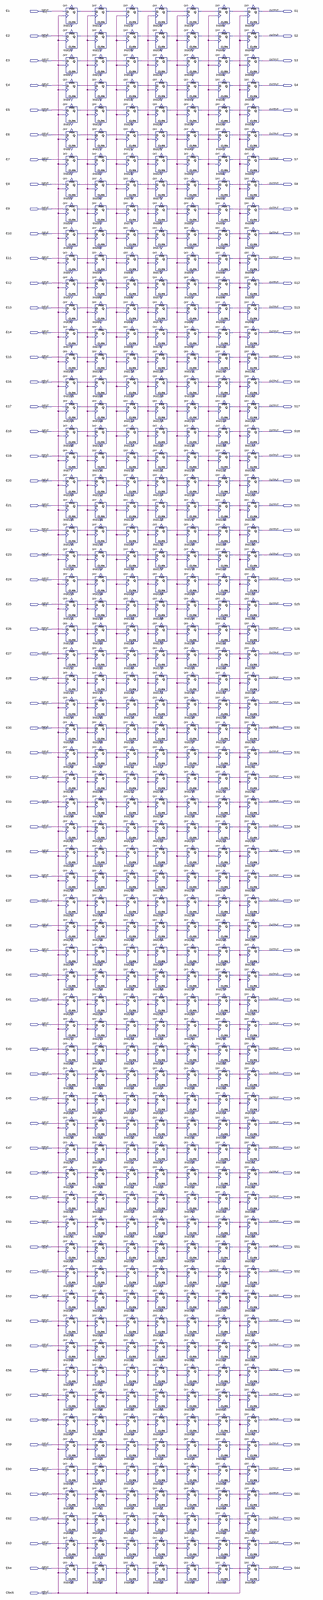
[diagram p0: schematic sheet, whole]
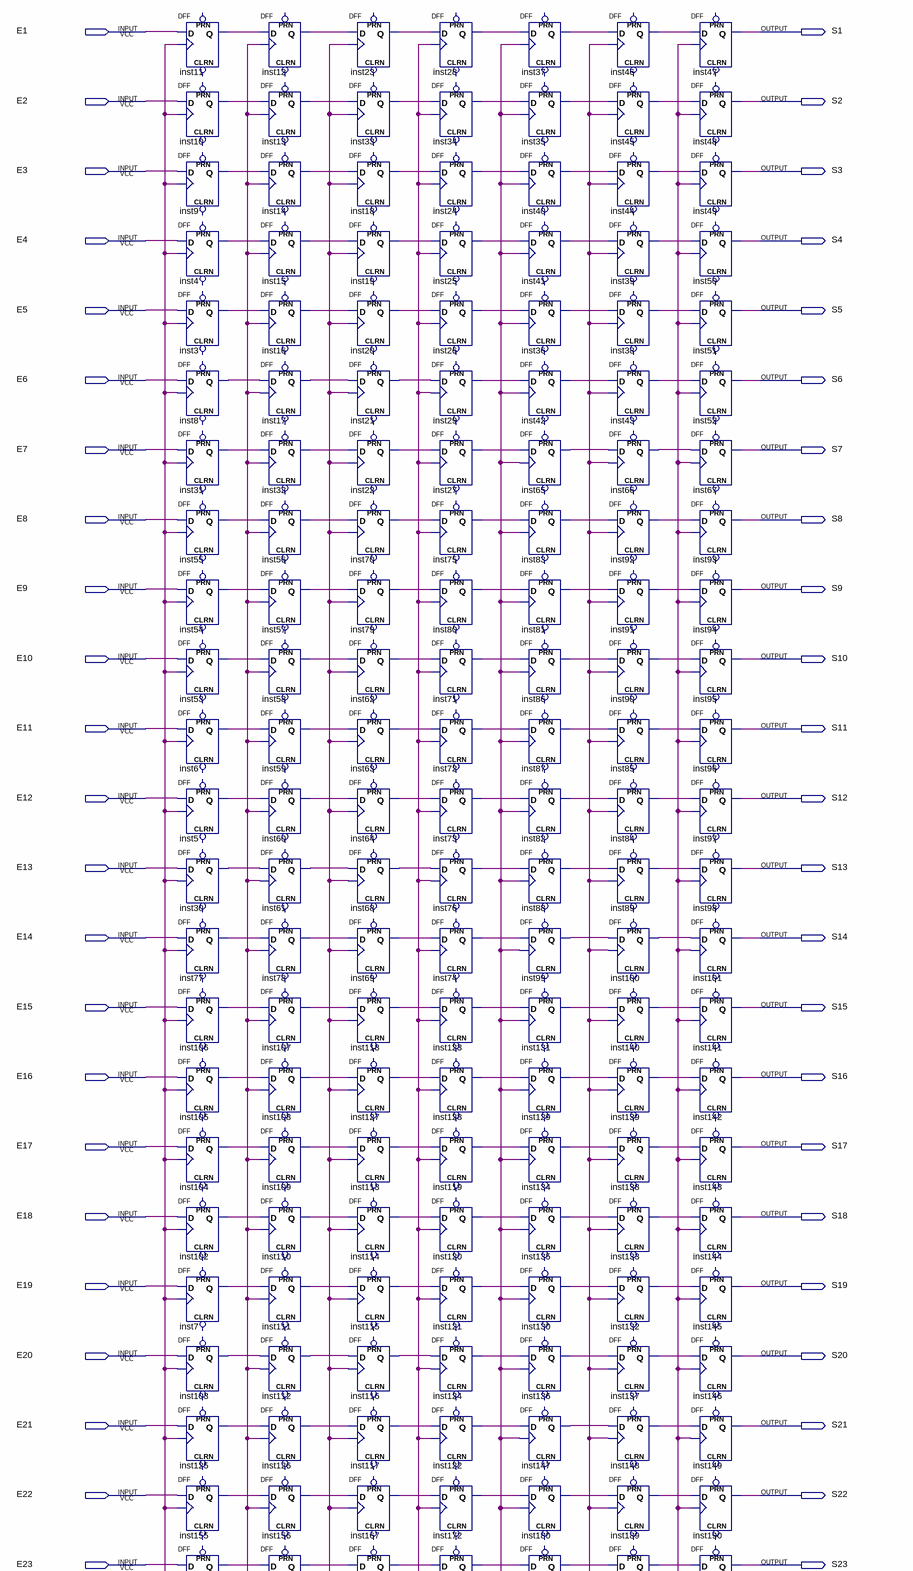
[diagram p1: schematic sheet, upper part]
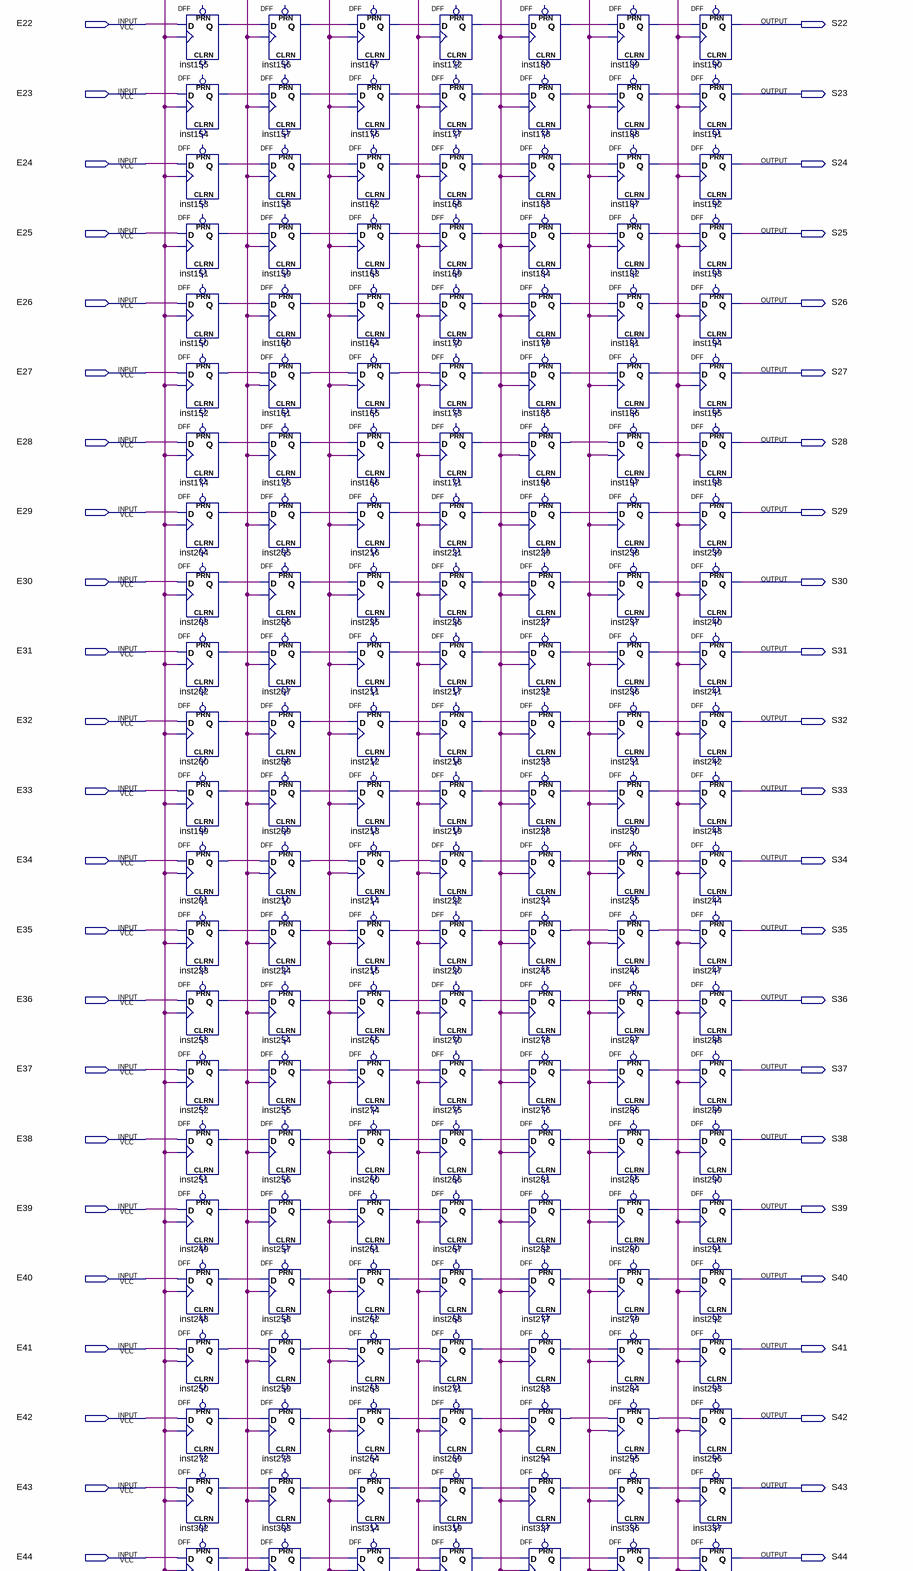
[diagram p2: schematic sheet, middle part]
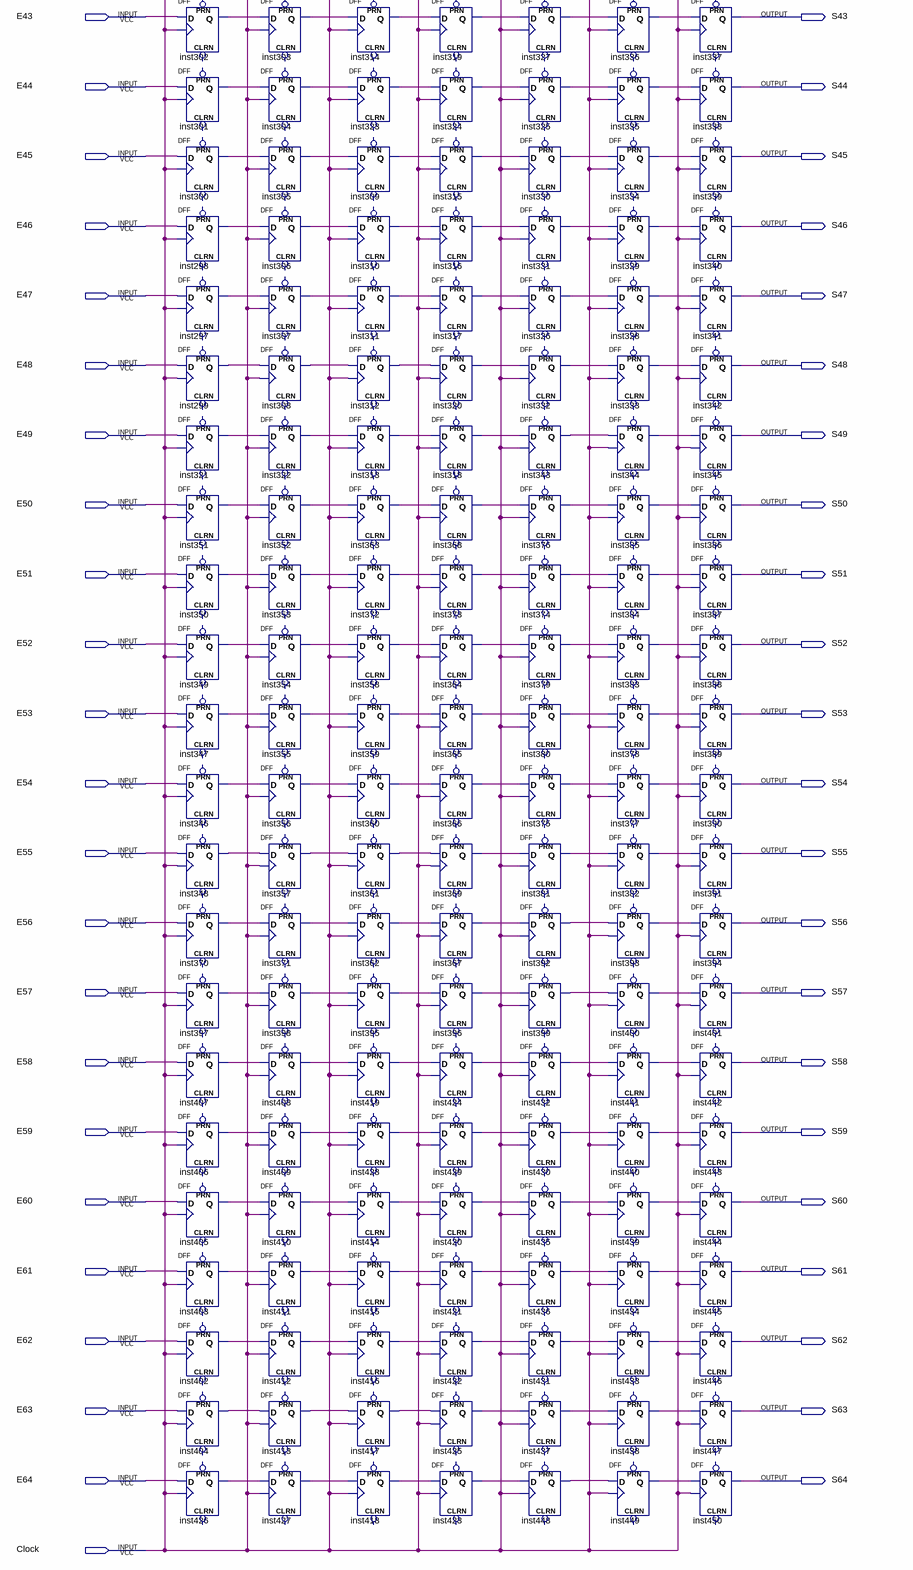
[diagram p3: schematic sheet, lower part]
// Quartus schematic Memoria.bdf as structural Verilog: 448 symbols, 129 pins
module Memoria (
  input  E1,
  input  E2,
  input  E3,
  input  E4,
  input  E5,
  input  E6,
  input  E7,
  input  E8,
  input  E9,
  input  E10,
  input  E11,
  input  E12,
  input  E13,
  input  E14,
  input  E15,
  input  E16,
  input  E17,
  input  E18,
  input  E19,
  input  E20,
  input  E21,
  input  E22,
  input  E23,
  input  E24,
  input  E25,
  input  E26,
  input  E27,
  input  E28,
  input  E29,
  input  E30,
  input  E31,
  input  E32,
  input  E33,
  input  E34,
  input  E35,
  input  E36,
  input  E37,
  input  E38,
  input  E39,
  input  E40,
  input  E41,
  input  E42,
  input  E43,
  input  E44,
  input  E45,
  input  E46,
  input  E47,
  input  E48,
  input  E49,
  input  E50,
  input  E51,
  input  E52,
  input  E53,
  input  E54,
  input  E55,
  input  E56,
  input  E57,
  input  E58,
  input  E59,
  input  E60,
  input  E61,
  input  E62,
  input  E63,
  input  E64,
  input  Clock,
  output S1,
  output S2,
  output S3,
  output S4,
  output S5,
  output S6,
  output S7,
  output S8,
  output S9,
  output S10,
  output S11,
  output S12,
  output S13,
  output S14,
  output S15,
  output S16,
  output S17,
  output S18,
  output S19,
  output S20,
  output S21,
  output S22,
  output S23,
  output S24,
  output S25,
  output S26,
  output S27,
  output S28,
  output S29,
  output S30,
  output S31,
  output S32,
  output S33,
  output S34,
  output S35,
  output S36,
  output S37,
  output S38,
  output S39,
  output S40,
  output S41,
  output S42,
  output S43,
  output S44,
  output S45,
  output S46,
  output S47,
  output S48,
  output S49,
  output S50,
  output S51,
  output S52,
  output S53,
  output S54,
  output S55,
  output S56,
  output S57,
  output S58,
  output S59,
  output S60,
  output S61,
  output S62,
  output S63,
  output S64
);

  wire inst3_q, inst4_q, inst5_q, inst6_q, inst7_q, inst8_q, inst9_q, inst10_q, inst11_q, inst12_q, inst13_q,
       inst14_q, inst15_q, inst16_q, inst17_q, inst18_q, inst19_q, inst20_q, inst21_q, inst22_q, inst23_q,
       inst24_q, inst25_q, inst26_q, inst27_q, inst28_q, inst29_q, inst30_q, inst31_q, inst32_q, inst33_q,
       inst34_q, inst35_q, inst36_q, inst37_q, inst38_q, inst39_q, inst40_q, inst41_q, inst42_q, inst43_q,
       inst44_q, inst45_q, inst46_q, inst53_q, inst54_q, inst55_q, inst56_q, inst57_q, inst58_q, inst59_q,
       inst60_q, inst61_q, inst62_q, inst63_q, inst64_q, inst65_q, inst66_q, inst68_q, inst69_q, inst70_q,
       inst71_q, inst72_q, inst73_q, inst74_q, inst75_q, inst76_q, inst77_q, inst78_q, inst79_q, inst80_q,
       inst81_q, inst82_q, inst83_q, inst84_q, inst85_q, inst86_q, inst87_q, inst88_q, inst89_q, inst90_q,
       inst91_q, inst92_q, inst99_q, inst100_q, inst102_q, inst103_q, inst104_q, inst105_q, inst106_q,
       inst107_q, inst108_q, inst109_q, inst110_q, inst111_q, inst112_q, inst113_q, inst114_q, inst115_q,
       inst116_q, inst117_q, inst118_q, inst119_q, inst120_q, inst121_q, inst122_q, inst123_q, inst124_q,
       inst125_q, inst126_q, inst127_q, inst128_q, inst129_q, inst130_q, inst131_q, inst132_q, inst133_q,
       inst134_q, inst135_q, inst136_q, inst137_q, inst138_q, inst139_q, inst140_q, inst147_q, inst148_q,
       inst150_q, inst151_q, inst152_q, inst153_q, inst154_q, inst155_q, inst156_q, inst157_q, inst158_q,
       inst159_q, inst160_q, inst161_q, inst162_q, inst163_q, inst164_q, inst165_q, inst166_q, inst167_q,
       inst168_q, inst169_q, inst170_q, inst171_q, inst172_q, inst173_q, inst174_q, inst175_q, inst176_q,
       inst177_q, inst178_q, inst179_q, inst180_q, inst181_q, inst182_q, inst183_q, inst184_q, inst185_q,
       inst186_q, inst187_q, inst188_q, inst189_q, inst196_q, inst197_q, inst199_q, inst200_q, inst201_q,
       inst202_q, inst203_q, inst204_q, inst205_q, inst206_q, inst207_q, inst208_q, inst209_q, inst210_q,
       inst211_q, inst212_q, inst213_q, inst214_q, inst215_q, inst216_q, inst217_q, inst218_q, inst219_q,
       inst220_q, inst221_q, inst222_q, inst223_q, inst224_q, inst225_q, inst226_q, inst227_q, inst228_q,
       inst229_q, inst230_q, inst231_q, inst232_q, inst233_q, inst234_q, inst235_q, inst236_q, inst237_q,
       inst238_q, inst245_q, inst246_q, inst248_q, inst249_q, inst250_q, inst251_q, inst252_q, inst253_q,
       inst254_q, inst255_q, inst256_q, inst257_q, inst258_q, inst259_q, inst260_q, inst261_q, inst262_q,
       inst263_q, inst264_q, inst265_q, inst266_q, inst267_q, inst268_q, inst269_q, inst270_q, inst271_q,
       inst272_q, inst273_q, inst274_q, inst275_q, inst276_q, inst277_q, inst278_q, inst279_q, inst280_q,
       inst281_q, inst282_q, inst283_q, inst284_q, inst285_q, inst286_q, inst287_q, inst294_q, inst295_q,
       inst297_q, inst298_q, inst299_q, inst300_q, inst301_q, inst302_q, inst303_q, inst304_q, inst305_q,
       inst306_q, inst307_q, inst308_q, inst309_q, inst310_q, inst311_q, inst312_q, inst313_q, inst314_q,
       inst315_q, inst316_q, inst317_q, inst318_q, inst319_q, inst320_q, inst321_q, inst322_q, inst323_q,
       inst324_q, inst325_q, inst326_q, inst327_q, inst328_q, inst329_q, inst330_q, inst331_q, inst332_q,
       inst333_q, inst334_q, inst335_q, inst336_q, inst343_q, inst344_q, inst346_q, inst347_q, inst348_q,
       inst349_q, inst350_q, inst351_q, inst352_q, inst353_q, inst354_q, inst355_q, inst356_q, inst357_q,
       inst358_q, inst359_q, inst360_q, inst361_q, inst362_q, inst363_q, inst364_q, inst365_q, inst366_q,
       inst367_q, inst368_q, inst369_q, inst370_q, inst371_q, inst372_q, inst373_q, inst374_q, inst375_q,
       inst376_q, inst377_q, inst378_q, inst379_q, inst380_q, inst381_q, inst382_q, inst383_q, inst384_q,
       inst385_q, inst392_q, inst393_q, inst395_q, inst396_q, inst397_q, inst398_q, inst399_q, inst400_q,
       inst402_q, inst403_q, inst404_q, inst405_q, inst406_q, inst407_q, inst408_q, inst409_q, inst410_q,
       inst411_q, inst412_q, inst413_q, inst414_q, inst415_q, inst416_q, inst417_q, inst418_q, inst419_q,
       inst420_q, inst421_q, inst422_q, inst423_q, inst424_q, inst425_q, inst426_q, inst427_q, inst428_q,
       inst429_q, inst430_q, inst431_q, inst432_q, inst433_q, inst434_q, inst435_q, inst436_q, inst437_q,
       inst438_q, inst439_q, inst440_q, inst441_q, inst448_q, inst449_q;

  DFF inst11 (.CLK(Clock), .D(E1), .Q(inst11_q));  // open: CLRN, PRN
  DFF inst10 (.CLK(Clock), .D(E2), .Q(inst10_q));  // open: CLRN, PRN
  DFF inst9 (.CLK(Clock), .D(E3), .Q(inst9_q));  // open: CLRN, PRN
  DFF inst4 (.CLK(Clock), .D(E4), .Q(inst4_q));  // open: CLRN, PRN
  DFF inst3 (.CLK(Clock), .D(E5), .Q(inst3_q));  // open: CLRN, PRN
  DFF inst8 (.CLK(Clock), .D(E6), .Q(inst8_q));  // open: CLRN, PRN
  DFF inst31 (.CLK(Clock), .D(E7), .Q(inst31_q));  // open: CLRN, PRN
  DFF inst55 (.CLK(Clock), .D(E8), .Q(inst55_q));  // open: CLRN, PRN
  DFF inst54 (.CLK(Clock), .D(E9), .Q(inst54_q));  // open: CLRN, PRN
  DFF inst53 (.CLK(Clock), .D(E10), .Q(inst53_q));  // open: CLRN, PRN
  DFF inst6 (.CLK(Clock), .D(E11), .Q(inst6_q));  // open: CLRN, PRN
  DFF inst5 (.CLK(Clock), .D(E12), .Q(inst5_q));  // open: CLRN, PRN
  DFF inst30 (.CLK(Clock), .D(E13), .Q(inst30_q));  // open: CLRN, PRN
  DFF inst77 (.CLK(Clock), .D(E14), .Q(inst77_q));  // open: CLRN, PRN
  DFF inst106 (.CLK(Clock), .D(E15), .Q(inst106_q));  // open: CLRN, PRN
  DFF inst105 (.CLK(Clock), .D(E16), .Q(inst105_q));  // open: CLRN, PRN
  DFF inst104 (.CLK(Clock), .D(E17), .Q(inst104_q));  // open: CLRN, PRN
  DFF inst102 (.CLK(Clock), .D(E18), .Q(inst102_q));  // open: CLRN, PRN
  DFF inst7 (.CLK(Clock), .D(E19), .Q(inst7_q));  // open: CLRN, PRN
  DFF inst103 (.CLK(Clock), .D(E20), .Q(inst103_q));  // open: CLRN, PRN
  DFF inst125 (.CLK(Clock), .D(E21), .Q(inst125_q));  // open: CLRN, PRN
  DFF inst155 (.CLK(Clock), .D(E22), .Q(inst155_q));  // open: CLRN, PRN
  DFF inst154 (.CLK(Clock), .D(E23), .Q(inst154_q));  // open: CLRN, PRN
  DFF inst153 (.CLK(Clock), .D(E24), .Q(inst153_q));  // open: CLRN, PRN
  DFF inst151 (.CLK(Clock), .D(E25), .Q(inst151_q));  // open: CLRN, PRN
  DFF inst150 (.CLK(Clock), .D(E26), .Q(inst150_q));  // open: CLRN, PRN
  DFF inst152 (.CLK(Clock), .D(E27), .Q(inst152_q));  // open: CLRN, PRN
  DFF inst174 (.CLK(Clock), .D(E28), .Q(inst174_q));  // open: CLRN, PRN
  DFF inst204 (.CLK(Clock), .D(E29), .Q(inst204_q));  // open: CLRN, PRN
  DFF inst203 (.CLK(Clock), .D(E30), .Q(inst203_q));  // open: CLRN, PRN
  DFF inst202 (.CLK(Clock), .D(E31), .Q(inst202_q));  // open: CLRN, PRN
  DFF inst200 (.CLK(Clock), .D(E32), .Q(inst200_q));  // open: CLRN, PRN
  DFF inst199 (.CLK(Clock), .D(E33), .Q(inst199_q));  // open: CLRN, PRN
  DFF inst201 (.CLK(Clock), .D(E34), .Q(inst201_q));  // open: CLRN, PRN
  DFF inst223 (.CLK(Clock), .D(E35), .Q(inst223_q));  // open: CLRN, PRN
  DFF inst253 (.CLK(Clock), .D(E36), .Q(inst253_q));  // open: CLRN, PRN
  DFF inst252 (.CLK(Clock), .D(E37), .Q(inst252_q));  // open: CLRN, PRN
  DFF inst251 (.CLK(Clock), .D(E38), .Q(inst251_q));  // open: CLRN, PRN
  DFF inst249 (.CLK(Clock), .D(E39), .Q(inst249_q));  // open: CLRN, PRN
  DFF inst248 (.CLK(Clock), .D(E40), .Q(inst248_q));  // open: CLRN, PRN
  DFF inst250 (.CLK(Clock), .D(E41), .Q(inst250_q));  // open: CLRN, PRN
  DFF inst272 (.CLK(Clock), .D(E42), .Q(inst272_q));  // open: CLRN, PRN
  DFF inst302 (.CLK(Clock), .D(E43), .Q(inst302_q));  // open: CLRN, PRN
  DFF inst301 (.CLK(Clock), .D(E44), .Q(inst301_q));  // open: CLRN, PRN
  DFF inst300 (.CLK(Clock), .D(E45), .Q(inst300_q));  // open: CLRN, PRN
  DFF inst298 (.CLK(Clock), .D(E46), .Q(inst298_q));  // open: CLRN, PRN
  DFF inst297 (.CLK(Clock), .D(E47), .Q(inst297_q));  // open: CLRN, PRN
  DFF inst299 (.CLK(Clock), .D(E48), .Q(inst299_q));  // open: CLRN, PRN
  DFF inst321 (.CLK(Clock), .D(E49), .Q(inst321_q));  // open: CLRN, PRN
  DFF inst351 (.CLK(Clock), .D(E50), .Q(inst351_q));  // open: CLRN, PRN
  DFF inst350 (.CLK(Clock), .D(E51), .Q(inst350_q));  // open: CLRN, PRN
  DFF inst349 (.CLK(Clock), .D(E52), .Q(inst349_q));  // open: CLRN, PRN
  DFF inst347 (.CLK(Clock), .D(E53), .Q(inst347_q));  // open: CLRN, PRN
  DFF inst346 (.CLK(Clock), .D(E54), .Q(inst346_q));  // open: CLRN, PRN
  DFF inst348 (.CLK(Clock), .D(E55), .Q(inst348_q));  // open: CLRN, PRN
  DFF inst370 (.CLK(Clock), .D(E56), .Q(inst370_q));  // open: CLRN, PRN
  DFF inst397 (.CLK(Clock), .D(E57), .Q(inst397_q));  // open: CLRN, PRN
  DFF inst407 (.CLK(Clock), .D(E58), .Q(inst407_q));  // open: CLRN, PRN
  DFF inst406 (.CLK(Clock), .D(E59), .Q(inst406_q));  // open: CLRN, PRN
  DFF inst405 (.CLK(Clock), .D(E60), .Q(inst405_q));  // open: CLRN, PRN
  DFF inst403 (.CLK(Clock), .D(E61), .Q(inst403_q));  // open: CLRN, PRN
  DFF inst402 (.CLK(Clock), .D(E62), .Q(inst402_q));  // open: CLRN, PRN
  DFF inst404 (.CLK(Clock), .D(E63), .Q(inst404_q));  // open: CLRN, PRN
  DFF inst426 (.CLK(Clock), .D(E64), .Q(inst426_q));  // open: CLRN, PRN
  DFF inst12 (.CLK(Clock), .D(inst11_q), .Q(inst12_q));  // open: CLRN, PRN
  DFF inst13 (.CLK(Clock), .D(inst10_q), .Q(inst13_q));  // open: CLRN, PRN
  DFF inst14 (.CLK(Clock), .D(inst9_q), .Q(inst14_q));  // open: CLRN, PRN
  DFF inst15 (.CLK(Clock), .D(inst4_q), .Q(inst15_q));  // open: CLRN, PRN
  DFF inst16 (.CLK(Clock), .D(inst3_q), .Q(inst16_q));  // open: CLRN, PRN
  DFF inst17 (.CLK(Clock), .D(inst8_q), .Q(inst17_q));  // open: CLRN, PRN
  DFF inst32 (.CLK(Clock), .D(inst31_q), .Q(inst32_q));  // open: CLRN, PRN
  DFF inst56 (.CLK(Clock), .D(inst55_q), .Q(inst56_q));  // open: CLRN, PRN
  DFF inst57 (.CLK(Clock), .D(inst54_q), .Q(inst57_q));  // open: CLRN, PRN
  DFF inst58 (.CLK(Clock), .D(inst53_q), .Q(inst58_q));  // open: CLRN, PRN
  DFF inst59 (.CLK(Clock), .D(inst6_q), .Q(inst59_q));  // open: CLRN, PRN
  DFF inst60 (.CLK(Clock), .D(inst5_q), .Q(inst60_q));  // open: CLRN, PRN
  DFF inst61 (.CLK(Clock), .D(inst30_q), .Q(inst61_q));  // open: CLRN, PRN
  DFF inst78 (.CLK(Clock), .D(inst77_q), .Q(inst78_q));  // open: CLRN, PRN
  DFF inst107 (.CLK(Clock), .D(inst106_q), .Q(inst107_q));  // open: CLRN, PRN
  DFF inst108 (.CLK(Clock), .D(inst105_q), .Q(inst108_q));  // open: CLRN, PRN
  DFF inst109 (.CLK(Clock), .D(inst104_q), .Q(inst109_q));  // open: CLRN, PRN
  DFF inst110 (.CLK(Clock), .D(inst102_q), .Q(inst110_q));  // open: CLRN, PRN
  DFF inst111 (.CLK(Clock), .D(inst7_q), .Q(inst111_q));  // open: CLRN, PRN
  DFF inst112 (.CLK(Clock), .D(inst103_q), .Q(inst112_q));  // open: CLRN, PRN
  DFF inst126 (.CLK(Clock), .D(inst125_q), .Q(inst126_q));  // open: CLRN, PRN
  DFF inst156 (.CLK(Clock), .D(inst155_q), .Q(inst156_q));  // open: CLRN, PRN
  DFF inst157 (.CLK(Clock), .D(inst154_q), .Q(inst157_q));  // open: CLRN, PRN
  DFF inst158 (.CLK(Clock), .D(inst153_q), .Q(inst158_q));  // open: CLRN, PRN
  DFF inst159 (.CLK(Clock), .D(inst151_q), .Q(inst159_q));  // open: CLRN, PRN
  DFF inst160 (.CLK(Clock), .D(inst150_q), .Q(inst160_q));  // open: CLRN, PRN
  DFF inst161 (.CLK(Clock), .D(inst152_q), .Q(inst161_q));  // open: CLRN, PRN
  DFF inst175 (.CLK(Clock), .D(inst174_q), .Q(inst175_q));  // open: CLRN, PRN
  DFF inst205 (.CLK(Clock), .D(inst204_q), .Q(inst205_q));  // open: CLRN, PRN
  DFF inst206 (.CLK(Clock), .D(inst203_q), .Q(inst206_q));  // open: CLRN, PRN
  DFF inst207 (.CLK(Clock), .D(inst202_q), .Q(inst207_q));  // open: CLRN, PRN
  DFF inst208 (.CLK(Clock), .D(inst200_q), .Q(inst208_q));  // open: CLRN, PRN
  DFF inst209 (.CLK(Clock), .D(inst199_q), .Q(inst209_q));  // open: CLRN, PRN
  DFF inst210 (.CLK(Clock), .D(inst201_q), .Q(inst210_q));  // open: CLRN, PRN
  DFF inst224 (.CLK(Clock), .D(inst223_q), .Q(inst224_q));  // open: CLRN, PRN
  DFF inst254 (.CLK(Clock), .D(inst253_q), .Q(inst254_q));  // open: CLRN, PRN
  DFF inst255 (.CLK(Clock), .D(inst252_q), .Q(inst255_q));  // open: CLRN, PRN
  DFF inst256 (.CLK(Clock), .D(inst251_q), .Q(inst256_q));  // open: CLRN, PRN
  DFF inst257 (.CLK(Clock), .D(inst249_q), .Q(inst257_q));  // open: CLRN, PRN
  DFF inst258 (.CLK(Clock), .D(inst248_q), .Q(inst258_q));  // open: CLRN, PRN
  DFF inst259 (.CLK(Clock), .D(inst250_q), .Q(inst259_q));  // open: CLRN, PRN
  DFF inst273 (.CLK(Clock), .D(inst272_q), .Q(inst273_q));  // open: CLRN, PRN
  DFF inst303 (.CLK(Clock), .D(inst302_q), .Q(inst303_q));  // open: CLRN, PRN
  DFF inst304 (.CLK(Clock), .D(inst301_q), .Q(inst304_q));  // open: CLRN, PRN
  DFF inst305 (.CLK(Clock), .D(inst300_q), .Q(inst305_q));  // open: CLRN, PRN
  DFF inst306 (.CLK(Clock), .D(inst298_q), .Q(inst306_q));  // open: CLRN, PRN
  DFF inst307 (.CLK(Clock), .D(inst297_q), .Q(inst307_q));  // open: CLRN, PRN
  DFF inst308 (.CLK(Clock), .D(inst299_q), .Q(inst308_q));  // open: CLRN, PRN
  DFF inst322 (.CLK(Clock), .D(inst321_q), .Q(inst322_q));  // open: CLRN, PRN
  DFF inst352 (.CLK(Clock), .D(inst351_q), .Q(inst352_q));  // open: CLRN, PRN
  DFF inst353 (.CLK(Clock), .D(inst350_q), .Q(inst353_q));  // open: CLRN, PRN
  DFF inst354 (.CLK(Clock), .D(inst349_q), .Q(inst354_q));  // open: CLRN, PRN
  DFF inst355 (.CLK(Clock), .D(inst347_q), .Q(inst355_q));  // open: CLRN, PRN
  DFF inst356 (.CLK(Clock), .D(inst346_q), .Q(inst356_q));  // open: CLRN, PRN
  DFF inst357 (.CLK(Clock), .D(inst348_q), .Q(inst357_q));  // open: CLRN, PRN
  DFF inst371 (.CLK(Clock), .D(inst370_q), .Q(inst371_q));  // open: CLRN, PRN
  DFF inst398 (.CLK(Clock), .D(inst397_q), .Q(inst398_q));  // open: CLRN, PRN
  DFF inst408 (.CLK(Clock), .D(inst407_q), .Q(inst408_q));  // open: CLRN, PRN
  DFF inst409 (.CLK(Clock), .D(inst406_q), .Q(inst409_q));  // open: CLRN, PRN
  DFF inst410 (.CLK(Clock), .D(inst405_q), .Q(inst410_q));  // open: CLRN, PRN
  DFF inst411 (.CLK(Clock), .D(inst403_q), .Q(inst411_q));  // open: CLRN, PRN
  DFF inst412 (.CLK(Clock), .D(inst402_q), .Q(inst412_q));  // open: CLRN, PRN
  DFF inst413 (.CLK(Clock), .D(inst404_q), .Q(inst413_q));  // open: CLRN, PRN
  DFF inst427 (.CLK(Clock), .D(inst426_q), .Q(inst427_q));  // open: CLRN, PRN
  DFF inst23 (.CLK(Clock), .D(inst12_q), .Q(inst23_q));  // open: CLRN, PRN
  DFF inst33 (.CLK(Clock), .D(inst13_q), .Q(inst33_q));  // open: CLRN, PRN
  DFF inst18 (.CLK(Clock), .D(inst14_q), .Q(inst18_q));  // open: CLRN, PRN
  DFF inst19 (.CLK(Clock), .D(inst15_q), .Q(inst19_q));  // open: CLRN, PRN
  DFF inst20 (.CLK(Clock), .D(inst16_q), .Q(inst20_q));  // open: CLRN, PRN
  DFF inst21 (.CLK(Clock), .D(inst17_q), .Q(inst21_q));  // open: CLRN, PRN
  DFF inst22 (.CLK(Clock), .D(inst32_q), .Q(inst22_q));  // open: CLRN, PRN
  DFF inst70 (.CLK(Clock), .D(inst56_q), .Q(inst70_q));  // open: CLRN, PRN
  DFF inst79 (.CLK(Clock), .D(inst57_q), .Q(inst79_q));  // open: CLRN, PRN
  DFF inst62 (.CLK(Clock), .D(inst58_q), .Q(inst62_q));  // open: CLRN, PRN
  DFF inst63 (.CLK(Clock), .D(inst59_q), .Q(inst63_q));  // open: CLRN, PRN
  DFF inst64 (.CLK(Clock), .D(inst60_q), .Q(inst64_q));  // open: CLRN, PRN
  DFF inst68 (.CLK(Clock), .D(inst61_q), .Q(inst68_q));  // open: CLRN, PRN
  DFF inst69 (.CLK(Clock), .D(inst78_q), .Q(inst69_q));  // open: CLRN, PRN
  DFF inst118 (.CLK(Clock), .D(inst107_q), .Q(inst118_q));  // open: CLRN, PRN
  DFF inst127 (.CLK(Clock), .D(inst108_q), .Q(inst127_q));  // open: CLRN, PRN
  DFF inst113 (.CLK(Clock), .D(inst109_q), .Q(inst113_q));  // open: CLRN, PRN
  DFF inst114 (.CLK(Clock), .D(inst110_q), .Q(inst114_q));  // open: CLRN, PRN
  DFF inst115 (.CLK(Clock), .D(inst111_q), .Q(inst115_q));  // open: CLRN, PRN
  DFF inst116 (.CLK(Clock), .D(inst112_q), .Q(inst116_q));  // open: CLRN, PRN
  DFF inst117 (.CLK(Clock), .D(inst126_q), .Q(inst117_q));  // open: CLRN, PRN
  DFF inst167 (.CLK(Clock), .D(inst156_q), .Q(inst167_q));  // open: CLRN, PRN
  DFF inst176 (.CLK(Clock), .D(inst157_q), .Q(inst176_q));  // open: CLRN, PRN
  DFF inst162 (.CLK(Clock), .D(inst158_q), .Q(inst162_q));  // open: CLRN, PRN
  DFF inst163 (.CLK(Clock), .D(inst159_q), .Q(inst163_q));  // open: CLRN, PRN
  DFF inst164 (.CLK(Clock), .D(inst160_q), .Q(inst164_q));  // open: CLRN, PRN
  DFF inst165 (.CLK(Clock), .D(inst161_q), .Q(inst165_q));  // open: CLRN, PRN
  DFF inst166 (.CLK(Clock), .D(inst175_q), .Q(inst166_q));  // open: CLRN, PRN
  DFF inst216 (.CLK(Clock), .D(inst205_q), .Q(inst216_q));  // open: CLRN, PRN
  DFF inst225 (.CLK(Clock), .D(inst206_q), .Q(inst225_q));  // open: CLRN, PRN
  DFF inst211 (.CLK(Clock), .D(inst207_q), .Q(inst211_q));  // open: CLRN, PRN
  DFF inst212 (.CLK(Clock), .D(inst208_q), .Q(inst212_q));  // open: CLRN, PRN
  DFF inst213 (.CLK(Clock), .D(inst209_q), .Q(inst213_q));  // open: CLRN, PRN
  DFF inst214 (.CLK(Clock), .D(inst210_q), .Q(inst214_q));  // open: CLRN, PRN
  DFF inst215 (.CLK(Clock), .D(inst224_q), .Q(inst215_q));  // open: CLRN, PRN
  DFF inst265 (.CLK(Clock), .D(inst254_q), .Q(inst265_q));  // open: CLRN, PRN
  DFF inst274 (.CLK(Clock), .D(inst255_q), .Q(inst274_q));  // open: CLRN, PRN
  DFF inst260 (.CLK(Clock), .D(inst256_q), .Q(inst260_q));  // open: CLRN, PRN
  DFF inst261 (.CLK(Clock), .D(inst257_q), .Q(inst261_q));  // open: CLRN, PRN
  DFF inst262 (.CLK(Clock), .D(inst258_q), .Q(inst262_q));  // open: CLRN, PRN
  DFF inst263 (.CLK(Clock), .D(inst259_q), .Q(inst263_q));  // open: CLRN, PRN
  DFF inst264 (.CLK(Clock), .D(inst273_q), .Q(inst264_q));  // open: CLRN, PRN
  DFF inst314 (.CLK(Clock), .D(inst303_q), .Q(inst314_q));  // open: CLRN, PRN
  DFF inst323 (.CLK(Clock), .D(inst304_q), .Q(inst323_q));  // open: CLRN, PRN
  DFF inst309 (.CLK(Clock), .D(inst305_q), .Q(inst309_q));  // open: CLRN, PRN
  DFF inst310 (.CLK(Clock), .D(inst306_q), .Q(inst310_q));  // open: CLRN, PRN
  DFF inst311 (.CLK(Clock), .D(inst307_q), .Q(inst311_q));  // open: CLRN, PRN
  DFF inst312 (.CLK(Clock), .D(inst308_q), .Q(inst312_q));  // open: CLRN, PRN
  DFF inst313 (.CLK(Clock), .D(inst322_q), .Q(inst313_q));  // open: CLRN, PRN
  DFF inst363 (.CLK(Clock), .D(inst352_q), .Q(inst363_q));  // open: CLRN, PRN
  DFF inst372 (.CLK(Clock), .D(inst353_q), .Q(inst372_q));  // open: CLRN, PRN
  DFF inst358 (.CLK(Clock), .D(inst354_q), .Q(inst358_q));  // open: CLRN, PRN
  DFF inst359 (.CLK(Clock), .D(inst355_q), .Q(inst359_q));  // open: CLRN, PRN
  DFF inst360 (.CLK(Clock), .D(inst356_q), .Q(inst360_q));  // open: CLRN, PRN
  DFF inst361 (.CLK(Clock), .D(inst357_q), .Q(inst361_q));  // open: CLRN, PRN
  DFF inst362 (.CLK(Clock), .D(inst371_q), .Q(inst362_q));  // open: CLRN, PRN
  DFF inst395 (.CLK(Clock), .D(inst398_q), .Q(inst395_q));  // open: CLRN, PRN
  DFF inst419 (.CLK(Clock), .D(inst408_q), .Q(inst419_q));  // open: CLRN, PRN
  DFF inst428 (.CLK(Clock), .D(inst409_q), .Q(inst428_q));  // open: CLRN, PRN
  DFF inst414 (.CLK(Clock), .D(inst410_q), .Q(inst414_q));  // open: CLRN, PRN
  DFF inst415 (.CLK(Clock), .D(inst411_q), .Q(inst415_q));  // open: CLRN, PRN
  DFF inst416 (.CLK(Clock), .D(inst412_q), .Q(inst416_q));  // open: CLRN, PRN
  DFF inst417 (.CLK(Clock), .D(inst413_q), .Q(inst417_q));  // open: CLRN, PRN
  DFF inst418 (.CLK(Clock), .D(inst427_q), .Q(inst418_q));  // open: CLRN, PRN
  DFF inst28 (.CLK(Clock), .D(inst23_q), .Q(inst28_q));  // open: CLRN, PRN
  DFF inst34 (.CLK(Clock), .D(inst33_q), .Q(inst34_q));  // open: CLRN, PRN
  DFF inst24 (.CLK(Clock), .D(inst18_q), .Q(inst24_q));  // open: CLRN, PRN
  DFF inst25 (.CLK(Clock), .D(inst19_q), .Q(inst25_q));  // open: CLRN, PRN
  DFF inst26 (.CLK(Clock), .D(inst20_q), .Q(inst26_q));  // open: CLRN, PRN
  DFF inst29 (.CLK(Clock), .D(inst21_q), .Q(inst29_q));  // open: CLRN, PRN
  DFF inst27 (.CLK(Clock), .D(inst22_q), .Q(inst27_q));  // open: CLRN, PRN
  DFF inst75 (.CLK(Clock), .D(inst70_q), .Q(inst75_q));  // open: CLRN, PRN
  DFF inst80 (.CLK(Clock), .D(inst79_q), .Q(inst80_q));  // open: CLRN, PRN
  DFF inst71 (.CLK(Clock), .D(inst62_q), .Q(inst71_q));  // open: CLRN, PRN
  DFF inst72 (.CLK(Clock), .D(inst63_q), .Q(inst72_q));  // open: CLRN, PRN
  DFF inst73 (.CLK(Clock), .D(inst64_q), .Q(inst73_q));  // open: CLRN, PRN
  DFF inst76 (.CLK(Clock), .D(inst68_q), .Q(inst76_q));  // open: CLRN, PRN
  DFF inst74 (.CLK(Clock), .D(inst69_q), .Q(inst74_q));  // open: CLRN, PRN
  DFF inst123 (.CLK(Clock), .D(inst118_q), .Q(inst123_q));  // open: CLRN, PRN
  DFF inst128 (.CLK(Clock), .D(inst127_q), .Q(inst128_q));  // open: CLRN, PRN
  DFF inst119 (.CLK(Clock), .D(inst113_q), .Q(inst119_q));  // open: CLRN, PRN
  DFF inst120 (.CLK(Clock), .D(inst114_q), .Q(inst120_q));  // open: CLRN, PRN
  DFF inst121 (.CLK(Clock), .D(inst115_q), .Q(inst121_q));  // open: CLRN, PRN
  DFF inst124 (.CLK(Clock), .D(inst116_q), .Q(inst124_q));  // open: CLRN, PRN
  DFF inst122 (.CLK(Clock), .D(inst117_q), .Q(inst122_q));  // open: CLRN, PRN
  DFF inst172 (.CLK(Clock), .D(inst167_q), .Q(inst172_q));  // open: CLRN, PRN
  DFF inst177 (.CLK(Clock), .D(inst176_q), .Q(inst177_q));  // open: CLRN, PRN
  DFF inst168 (.CLK(Clock), .D(inst162_q), .Q(inst168_q));  // open: CLRN, PRN
  DFF inst169 (.CLK(Clock), .D(inst163_q), .Q(inst169_q));  // open: CLRN, PRN
  DFF inst170 (.CLK(Clock), .D(inst164_q), .Q(inst170_q));  // open: CLRN, PRN
  DFF inst173 (.CLK(Clock), .D(inst165_q), .Q(inst173_q));  // open: CLRN, PRN
  DFF inst171 (.CLK(Clock), .D(inst166_q), .Q(inst171_q));  // open: CLRN, PRN
  DFF inst221 (.CLK(Clock), .D(inst216_q), .Q(inst221_q));  // open: CLRN, PRN
  DFF inst226 (.CLK(Clock), .D(inst225_q), .Q(inst226_q));  // open: CLRN, PRN
  DFF inst217 (.CLK(Clock), .D(inst211_q), .Q(inst217_q));  // open: CLRN, PRN
  DFF inst218 (.CLK(Clock), .D(inst212_q), .Q(inst218_q));  // open: CLRN, PRN
  DFF inst219 (.CLK(Clock), .D(inst213_q), .Q(inst219_q));  // open: CLRN, PRN
  DFF inst222 (.CLK(Clock), .D(inst214_q), .Q(inst222_q));  // open: CLRN, PRN
  DFF inst220 (.CLK(Clock), .D(inst215_q), .Q(inst220_q));  // open: CLRN, PRN
  DFF inst270 (.CLK(Clock), .D(inst265_q), .Q(inst270_q));  // open: CLRN, PRN
  DFF inst275 (.CLK(Clock), .D(inst274_q), .Q(inst275_q));  // open: CLRN, PRN
  DFF inst266 (.CLK(Clock), .D(inst260_q), .Q(inst266_q));  // open: CLRN, PRN
  DFF inst267 (.CLK(Clock), .D(inst261_q), .Q(inst267_q));  // open: CLRN, PRN
  DFF inst268 (.CLK(Clock), .D(inst262_q), .Q(inst268_q));  // open: CLRN, PRN
  DFF inst271 (.CLK(Clock), .D(inst263_q), .Q(inst271_q));  // open: CLRN, PRN
  DFF inst269 (.CLK(Clock), .D(inst264_q), .Q(inst269_q));  // open: CLRN, PRN
  DFF inst319 (.CLK(Clock), .D(inst314_q), .Q(inst319_q));  // open: CLRN, PRN
  DFF inst324 (.CLK(Clock), .D(inst323_q), .Q(inst324_q));  // open: CLRN, PRN
  DFF inst315 (.CLK(Clock), .D(inst309_q), .Q(inst315_q));  // open: CLRN, PRN
  DFF inst316 (.CLK(Clock), .D(inst310_q), .Q(inst316_q));  // open: CLRN, PRN
  DFF inst317 (.CLK(Clock), .D(inst311_q), .Q(inst317_q));  // open: CLRN, PRN
  DFF inst320 (.CLK(Clock), .D(inst312_q), .Q(inst320_q));  // open: CLRN, PRN
  DFF inst318 (.CLK(Clock), .D(inst313_q), .Q(inst318_q));  // open: CLRN, PRN
  DFF inst368 (.CLK(Clock), .D(inst363_q), .Q(inst368_q));  // open: CLRN, PRN
  DFF inst373 (.CLK(Clock), .D(inst372_q), .Q(inst373_q));  // open: CLRN, PRN
  DFF inst364 (.CLK(Clock), .D(inst358_q), .Q(inst364_q));  // open: CLRN, PRN
  DFF inst365 (.CLK(Clock), .D(inst359_q), .Q(inst365_q));  // open: CLRN, PRN
  DFF inst366 (.CLK(Clock), .D(inst360_q), .Q(inst366_q));  // open: CLRN, PRN
  DFF inst369 (.CLK(Clock), .D(inst361_q), .Q(inst369_q));  // open: CLRN, PRN
  DFF inst367 (.CLK(Clock), .D(inst362_q), .Q(inst367_q));  // open: CLRN, PRN
  DFF inst396 (.CLK(Clock), .D(inst395_q), .Q(inst396_q));  // open: CLRN, PRN
  DFF inst424 (.CLK(Clock), .D(inst419_q), .Q(inst424_q));  // open: CLRN, PRN
  DFF inst429 (.CLK(Clock), .D(inst428_q), .Q(inst429_q));  // open: CLRN, PRN
  DFF inst420 (.CLK(Clock), .D(inst414_q), .Q(inst420_q));  // open: CLRN, PRN
  DFF inst421 (.CLK(Clock), .D(inst415_q), .Q(inst421_q));  // open: CLRN, PRN
  DFF inst422 (.CLK(Clock), .D(inst416_q), .Q(inst422_q));  // open: CLRN, PRN
  DFF inst425 (.CLK(Clock), .D(inst417_q), .Q(inst425_q));  // open: CLRN, PRN
  DFF inst423 (.CLK(Clock), .D(inst418_q), .Q(inst423_q));  // open: CLRN, PRN
  DFF inst37 (.CLK(Clock), .D(inst28_q), .Q(inst37_q));  // open: CLRN, PRN
  DFF inst35 (.CLK(Clock), .D(inst34_q), .Q(inst35_q));  // open: CLRN, PRN
  DFF inst40 (.CLK(Clock), .D(inst24_q), .Q(inst40_q));  // open: CLRN, PRN
  DFF inst41 (.CLK(Clock), .D(inst25_q), .Q(inst41_q));  // open: CLRN, PRN
  DFF inst36 (.CLK(Clock), .D(inst26_q), .Q(inst36_q));  // open: CLRN, PRN
  DFF inst42 (.CLK(Clock), .D(inst29_q), .Q(inst42_q));  // open: CLRN, PRN
  DFF inst65 (.CLK(Clock), .D(inst27_q), .Q(inst65_q));  // open: CLRN, PRN
  DFF inst83 (.CLK(Clock), .D(inst75_q), .Q(inst83_q));  // open: CLRN, PRN
  DFF inst81 (.CLK(Clock), .D(inst80_q), .Q(inst81_q));  // open: CLRN, PRN
  DFF inst86 (.CLK(Clock), .D(inst71_q), .Q(inst86_q));  // open: CLRN, PRN
  DFF inst87 (.CLK(Clock), .D(inst72_q), .Q(inst87_q));  // open: CLRN, PRN
  DFF inst82 (.CLK(Clock), .D(inst73_q), .Q(inst82_q));  // open: CLRN, PRN
  DFF inst88 (.CLK(Clock), .D(inst76_q), .Q(inst88_q));  // open: CLRN, PRN
  DFF inst99 (.CLK(Clock), .D(inst74_q), .Q(inst99_q));  // open: CLRN, PRN
  DFF inst131 (.CLK(Clock), .D(inst123_q), .Q(inst131_q));  // open: CLRN, PRN
  DFF inst129 (.CLK(Clock), .D(inst128_q), .Q(inst129_q));  // open: CLRN, PRN
  DFF inst134 (.CLK(Clock), .D(inst119_q), .Q(inst134_q));  // open: CLRN, PRN
  DFF inst135 (.CLK(Clock), .D(inst120_q), .Q(inst135_q));  // open: CLRN, PRN
  DFF inst130 (.CLK(Clock), .D(inst121_q), .Q(inst130_q));  // open: CLRN, PRN
  DFF inst136 (.CLK(Clock), .D(inst124_q), .Q(inst136_q));  // open: CLRN, PRN
  DFF inst147 (.CLK(Clock), .D(inst122_q), .Q(inst147_q));  // open: CLRN, PRN
  DFF inst180 (.CLK(Clock), .D(inst172_q), .Q(inst180_q));  // open: CLRN, PRN
  DFF inst178 (.CLK(Clock), .D(inst177_q), .Q(inst178_q));  // open: CLRN, PRN
  DFF inst183 (.CLK(Clock), .D(inst168_q), .Q(inst183_q));  // open: CLRN, PRN
  DFF inst184 (.CLK(Clock), .D(inst169_q), .Q(inst184_q));  // open: CLRN, PRN
  DFF inst179 (.CLK(Clock), .D(inst170_q), .Q(inst179_q));  // open: CLRN, PRN
  DFF inst185 (.CLK(Clock), .D(inst173_q), .Q(inst185_q));  // open: CLRN, PRN
  DFF inst196 (.CLK(Clock), .D(inst171_q), .Q(inst196_q));  // open: CLRN, PRN
  DFF inst229 (.CLK(Clock), .D(inst221_q), .Q(inst229_q));  // open: CLRN, PRN
  DFF inst227 (.CLK(Clock), .D(inst226_q), .Q(inst227_q));  // open: CLRN, PRN
  DFF inst232 (.CLK(Clock), .D(inst217_q), .Q(inst232_q));  // open: CLRN, PRN
  DFF inst233 (.CLK(Clock), .D(inst218_q), .Q(inst233_q));  // open: CLRN, PRN
  DFF inst228 (.CLK(Clock), .D(inst219_q), .Q(inst228_q));  // open: CLRN, PRN
  DFF inst234 (.CLK(Clock), .D(inst222_q), .Q(inst234_q));  // open: CLRN, PRN
  DFF inst245 (.CLK(Clock), .D(inst220_q), .Q(inst245_q));  // open: CLRN, PRN
  DFF inst278 (.CLK(Clock), .D(inst270_q), .Q(inst278_q));  // open: CLRN, PRN
  DFF inst276 (.CLK(Clock), .D(inst275_q), .Q(inst276_q));  // open: CLRN, PRN
  DFF inst281 (.CLK(Clock), .D(inst266_q), .Q(inst281_q));  // open: CLRN, PRN
  DFF inst282 (.CLK(Clock), .D(inst267_q), .Q(inst282_q));  // open: CLRN, PRN
  DFF inst277 (.CLK(Clock), .D(inst268_q), .Q(inst277_q));  // open: CLRN, PRN
  DFF inst283 (.CLK(Clock), .D(inst271_q), .Q(inst283_q));  // open: CLRN, PRN
  DFF inst294 (.CLK(Clock), .D(inst269_q), .Q(inst294_q));  // open: CLRN, PRN
  DFF inst327 (.CLK(Clock), .D(inst319_q), .Q(inst327_q));  // open: CLRN, PRN
  DFF inst325 (.CLK(Clock), .D(inst324_q), .Q(inst325_q));  // open: CLRN, PRN
  DFF inst330 (.CLK(Clock), .D(inst315_q), .Q(inst330_q));  // open: CLRN, PRN
  DFF inst331 (.CLK(Clock), .D(inst316_q), .Q(inst331_q));  // open: CLRN, PRN
  DFF inst326 (.CLK(Clock), .D(inst317_q), .Q(inst326_q));  // open: CLRN, PRN
  DFF inst332 (.CLK(Clock), .D(inst320_q), .Q(inst332_q));  // open: CLRN, PRN
  DFF inst343 (.CLK(Clock), .D(inst318_q), .Q(inst343_q));  // open: CLRN, PRN
  DFF inst376 (.CLK(Clock), .D(inst368_q), .Q(inst376_q));  // open: CLRN, PRN
  DFF inst374 (.CLK(Clock), .D(inst373_q), .Q(inst374_q));  // open: CLRN, PRN
  DFF inst379 (.CLK(Clock), .D(inst364_q), .Q(inst379_q));  // open: CLRN, PRN
  DFF inst380 (.CLK(Clock), .D(inst365_q), .Q(inst380_q));  // open: CLRN, PRN
  DFF inst375 (.CLK(Clock), .D(inst366_q), .Q(inst375_q));  // open: CLRN, PRN
  DFF inst381 (.CLK(Clock), .D(inst369_q), .Q(inst381_q));  // open: CLRN, PRN
  DFF inst392 (.CLK(Clock), .D(inst367_q), .Q(inst392_q));  // open: CLRN, PRN
  DFF inst399 (.CLK(Clock), .D(inst396_q), .Q(inst399_q));  // open: CLRN, PRN
  DFF inst432 (.CLK(Clock), .D(inst424_q), .Q(inst432_q));  // open: CLRN, PRN
  DFF inst430 (.CLK(Clock), .D(inst429_q), .Q(inst430_q));  // open: CLRN, PRN
  DFF inst435 (.CLK(Clock), .D(inst420_q), .Q(inst435_q));  // open: CLRN, PRN
  DFF inst436 (.CLK(Clock), .D(inst421_q), .Q(inst436_q));  // open: CLRN, PRN
  DFF inst431 (.CLK(Clock), .D(inst422_q), .Q(inst431_q));  // open: CLRN, PRN
  DFF inst437 (.CLK(Clock), .D(inst425_q), .Q(inst437_q));  // open: CLRN, PRN
  DFF inst448 (.CLK(Clock), .D(inst423_q), .Q(inst448_q));  // open: CLRN, PRN
  DFF inst46 (.CLK(Clock), .D(inst37_q), .Q(inst46_q));  // open: CLRN, PRN
  DFF inst45 (.CLK(Clock), .D(inst35_q), .Q(inst45_q));  // open: CLRN, PRN
  DFF inst44 (.CLK(Clock), .D(inst40_q), .Q(inst44_q));  // open: CLRN, PRN
  DFF inst39 (.CLK(Clock), .D(inst41_q), .Q(inst39_q));  // open: CLRN, PRN
  DFF inst38 (.CLK(Clock), .D(inst36_q), .Q(inst38_q));  // open: CLRN, PRN
  DFF inst43 (.CLK(Clock), .D(inst42_q), .Q(inst43_q));  // open: CLRN, PRN
  DFF inst66 (.CLK(Clock), .D(inst65_q), .Q(inst66_q));  // open: CLRN, PRN
  DFF inst92 (.CLK(Clock), .D(inst83_q), .Q(inst92_q));  // open: CLRN, PRN
  DFF inst91 (.CLK(Clock), .D(inst81_q), .Q(inst91_q));  // open: CLRN, PRN
  DFF inst90 (.CLK(Clock), .D(inst86_q), .Q(inst90_q));  // open: CLRN, PRN
  DFF inst85 (.CLK(Clock), .D(inst87_q), .Q(inst85_q));  // open: CLRN, PRN
  DFF inst84 (.CLK(Clock), .D(inst82_q), .Q(inst84_q));  // open: CLRN, PRN
  DFF inst89 (.CLK(Clock), .D(inst88_q), .Q(inst89_q));  // open: CLRN, PRN
  DFF inst100 (.CLK(Clock), .D(inst99_q), .Q(inst100_q));  // open: CLRN, PRN
  DFF inst140 (.CLK(Clock), .D(inst131_q), .Q(inst140_q));  // open: CLRN, PRN
  DFF inst139 (.CLK(Clock), .D(inst129_q), .Q(inst139_q));  // open: CLRN, PRN
  DFF inst138 (.CLK(Clock), .D(inst134_q), .Q(inst138_q));  // open: CLRN, PRN
  DFF inst133 (.CLK(Clock), .D(inst135_q), .Q(inst133_q));  // open: CLRN, PRN
  DFF inst132 (.CLK(Clock), .D(inst130_q), .Q(inst132_q));  // open: CLRN, PRN
  DFF inst137 (.CLK(Clock), .D(inst136_q), .Q(inst137_q));  // open: CLRN, PRN
  DFF inst148 (.CLK(Clock), .D(inst147_q), .Q(inst148_q));  // open: CLRN, PRN
  DFF inst189 (.CLK(Clock), .D(inst180_q), .Q(inst189_q));  // open: CLRN, PRN
  DFF inst188 (.CLK(Clock), .D(inst178_q), .Q(inst188_q));  // open: CLRN, PRN
  DFF inst187 (.CLK(Clock), .D(inst183_q), .Q(inst187_q));  // open: CLRN, PRN
  DFF inst182 (.CLK(Clock), .D(inst184_q), .Q(inst182_q));  // open: CLRN, PRN
  DFF inst181 (.CLK(Clock), .D(inst179_q), .Q(inst181_q));  // open: CLRN, PRN
  DFF inst186 (.CLK(Clock), .D(inst185_q), .Q(inst186_q));  // open: CLRN, PRN
  DFF inst197 (.CLK(Clock), .D(inst196_q), .Q(inst197_q));  // open: CLRN, PRN
  DFF inst238 (.CLK(Clock), .D(inst229_q), .Q(inst238_q));  // open: CLRN, PRN
  DFF inst237 (.CLK(Clock), .D(inst227_q), .Q(inst237_q));  // open: CLRN, PRN
  DFF inst236 (.CLK(Clock), .D(inst232_q), .Q(inst236_q));  // open: CLRN, PRN
  DFF inst231 (.CLK(Clock), .D(inst233_q), .Q(inst231_q));  // open: CLRN, PRN
  DFF inst230 (.CLK(Clock), .D(inst228_q), .Q(inst230_q));  // open: CLRN, PRN
  DFF inst235 (.CLK(Clock), .D(inst234_q), .Q(inst235_q));  // open: CLRN, PRN
  DFF inst246 (.CLK(Clock), .D(inst245_q), .Q(inst246_q));  // open: CLRN, PRN
  DFF inst287 (.CLK(Clock), .D(inst278_q), .Q(inst287_q));  // open: CLRN, PRN
  DFF inst286 (.CLK(Clock), .D(inst276_q), .Q(inst286_q));  // open: CLRN, PRN
  DFF inst285 (.CLK(Clock), .D(inst281_q), .Q(inst285_q));  // open: CLRN, PRN
  DFF inst280 (.CLK(Clock), .D(inst282_q), .Q(inst280_q));  // open: CLRN, PRN
  DFF inst279 (.CLK(Clock), .D(inst277_q), .Q(inst279_q));  // open: CLRN, PRN
  DFF inst284 (.CLK(Clock), .D(inst283_q), .Q(inst284_q));  // open: CLRN, PRN
  DFF inst295 (.CLK(Clock), .D(inst294_q), .Q(inst295_q));  // open: CLRN, PRN
  DFF inst336 (.CLK(Clock), .D(inst327_q), .Q(inst336_q));  // open: CLRN, PRN
  DFF inst335 (.CLK(Clock), .D(inst325_q), .Q(inst335_q));  // open: CLRN, PRN
  DFF inst334 (.CLK(Clock), .D(inst330_q), .Q(inst334_q));  // open: CLRN, PRN
  DFF inst329 (.CLK(Clock), .D(inst331_q), .Q(inst329_q));  // open: CLRN, PRN
  DFF inst328 (.CLK(Clock), .D(inst326_q), .Q(inst328_q));  // open: CLRN, PRN
  DFF inst333 (.CLK(Clock), .D(inst332_q), .Q(inst333_q));  // open: CLRN, PRN
  DFF inst344 (.CLK(Clock), .D(inst343_q), .Q(inst344_q));  // open: CLRN, PRN
  DFF inst385 (.CLK(Clock), .D(inst376_q), .Q(inst385_q));  // open: CLRN, PRN
  DFF inst384 (.CLK(Clock), .D(inst374_q), .Q(inst384_q));  // open: CLRN, PRN
  DFF inst383 (.CLK(Clock), .D(inst379_q), .Q(inst383_q));  // open: CLRN, PRN
  DFF inst378 (.CLK(Clock), .D(inst380_q), .Q(inst378_q));  // open: CLRN, PRN
  DFF inst377 (.CLK(Clock), .D(inst375_q), .Q(inst377_q));  // open: CLRN, PRN
  DFF inst382 (.CLK(Clock), .D(inst381_q), .Q(inst382_q));  // open: CLRN, PRN
  DFF inst393 (.CLK(Clock), .D(inst392_q), .Q(inst393_q));  // open: CLRN, PRN
  DFF inst400 (.CLK(Clock), .D(inst399_q), .Q(inst400_q));  // open: CLRN, PRN
  DFF inst441 (.CLK(Clock), .D(inst432_q), .Q(inst441_q));  // open: CLRN, PRN
  DFF inst440 (.CLK(Clock), .D(inst430_q), .Q(inst440_q));  // open: CLRN, PRN
  DFF inst439 (.CLK(Clock), .D(inst435_q), .Q(inst439_q));  // open: CLRN, PRN
  DFF inst434 (.CLK(Clock), .D(inst436_q), .Q(inst434_q));  // open: CLRN, PRN
  DFF inst433 (.CLK(Clock), .D(inst431_q), .Q(inst433_q));  // open: CLRN, PRN
  DFF inst438 (.CLK(Clock), .D(inst437_q), .Q(inst438_q));  // open: CLRN, PRN
  DFF inst449 (.CLK(Clock), .D(inst448_q), .Q(inst449_q));  // open: CLRN, PRN
  DFF inst47 (.CLK(Clock), .D(inst46_q), .Q(S1));  // open: CLRN, PRN
  DFF inst48 (.CLK(Clock), .D(inst45_q), .Q(S2));  // open: CLRN, PRN
  DFF inst49 (.CLK(Clock), .D(inst44_q), .Q(S3));  // open: CLRN, PRN
  DFF inst50 (.CLK(Clock), .D(inst39_q), .Q(S4));  // open: CLRN, PRN
  DFF inst51 (.CLK(Clock), .D(inst38_q), .Q(S5));  // open: CLRN, PRN
  DFF inst52 (.CLK(Clock), .D(inst43_q), .Q(S6));  // open: CLRN, PRN
  DFF inst67 (.CLK(Clock), .D(inst66_q), .Q(S7));  // open: CLRN, PRN
  DFF inst93 (.CLK(Clock), .D(inst92_q), .Q(S8));  // open: CLRN, PRN
  DFF inst94 (.CLK(Clock), .D(inst91_q), .Q(S9));  // open: CLRN, PRN
  DFF inst95 (.CLK(Clock), .D(inst90_q), .Q(S10));  // open: CLRN, PRN
  DFF inst96 (.CLK(Clock), .D(inst85_q), .Q(S11));  // open: CLRN, PRN
  DFF inst97 (.CLK(Clock), .D(inst84_q), .Q(S12));  // open: CLRN, PRN
  DFF inst98 (.CLK(Clock), .D(inst89_q), .Q(S13));  // open: CLRN, PRN
  DFF inst101 (.CLK(Clock), .D(inst100_q), .Q(S14));  // open: CLRN, PRN
  DFF inst141 (.CLK(Clock), .D(inst140_q), .Q(S15));  // open: CLRN, PRN
  DFF inst142 (.CLK(Clock), .D(inst139_q), .Q(S16));  // open: CLRN, PRN
  DFF inst143 (.CLK(Clock), .D(inst138_q), .Q(S17));  // open: CLRN, PRN
  DFF inst144 (.CLK(Clock), .D(inst133_q), .Q(S18));  // open: CLRN, PRN
  DFF inst145 (.CLK(Clock), .D(inst132_q), .Q(S19));  // open: CLRN, PRN
  DFF inst146 (.CLK(Clock), .D(inst137_q), .Q(S20));  // open: CLRN, PRN
  DFF inst149 (.CLK(Clock), .D(inst148_q), .Q(S21));  // open: CLRN, PRN
  DFF inst190 (.CLK(Clock), .D(inst189_q), .Q(S22));  // open: CLRN, PRN
  DFF inst191 (.CLK(Clock), .D(inst188_q), .Q(S23));  // open: CLRN, PRN
  DFF inst192 (.CLK(Clock), .D(inst187_q), .Q(S24));  // open: CLRN, PRN
  DFF inst193 (.CLK(Clock), .D(inst182_q), .Q(S25));  // open: CLRN, PRN
  DFF inst194 (.CLK(Clock), .D(inst181_q), .Q(S26));  // open: CLRN, PRN
  DFF inst195 (.CLK(Clock), .D(inst186_q), .Q(S27));  // open: CLRN, PRN
  DFF inst198 (.CLK(Clock), .D(inst197_q), .Q(S28));  // open: CLRN, PRN
  DFF inst239 (.CLK(Clock), .D(inst238_q), .Q(S29));  // open: CLRN, PRN
  DFF inst240 (.CLK(Clock), .D(inst237_q), .Q(S30));  // open: CLRN, PRN
  DFF inst241 (.CLK(Clock), .D(inst236_q), .Q(S31));  // open: CLRN, PRN
  DFF inst242 (.CLK(Clock), .D(inst231_q), .Q(S32));  // open: CLRN, PRN
  DFF inst243 (.CLK(Clock), .D(inst230_q), .Q(S33));  // open: CLRN, PRN
  DFF inst244 (.CLK(Clock), .D(inst235_q), .Q(S34));  // open: CLRN, PRN
  DFF inst247 (.CLK(Clock), .D(inst246_q), .Q(S35));  // open: CLRN, PRN
  DFF inst288 (.CLK(Clock), .D(inst287_q), .Q(S36));  // open: CLRN, PRN
  DFF inst289 (.CLK(Clock), .D(inst286_q), .Q(S37));  // open: CLRN, PRN
  DFF inst290 (.CLK(Clock), .D(inst285_q), .Q(S38));  // open: CLRN, PRN
  DFF inst291 (.CLK(Clock), .D(inst280_q), .Q(S39));  // open: CLRN, PRN
  DFF inst292 (.CLK(Clock), .D(inst279_q), .Q(S40));  // open: CLRN, PRN
  DFF inst293 (.CLK(Clock), .D(inst284_q), .Q(S41));  // open: CLRN, PRN
  DFF inst296 (.CLK(Clock), .D(inst295_q), .Q(S42));  // open: CLRN, PRN
  DFF inst337 (.CLK(Clock), .D(inst336_q), .Q(S43));  // open: CLRN, PRN
  DFF inst338 (.CLK(Clock), .D(inst335_q), .Q(S44));  // open: CLRN, PRN
  DFF inst339 (.CLK(Clock), .D(inst334_q), .Q(S45));  // open: CLRN, PRN
  DFF inst340 (.CLK(Clock), .D(inst329_q), .Q(S46));  // open: CLRN, PRN
  DFF inst341 (.CLK(Clock), .D(inst328_q), .Q(S47));  // open: CLRN, PRN
  DFF inst342 (.CLK(Clock), .D(inst333_q), .Q(S48));  // open: CLRN, PRN
  DFF inst345 (.CLK(Clock), .D(inst344_q), .Q(S49));  // open: CLRN, PRN
  DFF inst386 (.CLK(Clock), .D(inst385_q), .Q(S50));  // open: CLRN, PRN
  DFF inst387 (.CLK(Clock), .D(inst384_q), .Q(S51));  // open: CLRN, PRN
  DFF inst388 (.CLK(Clock), .D(inst383_q), .Q(S52));  // open: CLRN, PRN
  DFF inst389 (.CLK(Clock), .D(inst378_q), .Q(S53));  // open: CLRN, PRN
  DFF inst390 (.CLK(Clock), .D(inst377_q), .Q(S54));  // open: CLRN, PRN
  DFF inst391 (.CLK(Clock), .D(inst382_q), .Q(S55));  // open: CLRN, PRN
  DFF inst394 (.CLK(Clock), .D(inst393_q), .Q(S56));  // open: CLRN, PRN
  DFF inst401 (.CLK(Clock), .D(inst400_q), .Q(S57));  // open: CLRN, PRN
  DFF inst442 (.CLK(Clock), .D(inst441_q), .Q(S58));  // open: CLRN, PRN
  DFF inst443 (.CLK(Clock), .D(inst440_q), .Q(S59));  // open: CLRN, PRN
  DFF inst444 (.CLK(Clock), .D(inst439_q), .Q(S60));  // open: CLRN, PRN
  DFF inst445 (.CLK(Clock), .D(inst434_q), .Q(S61));  // open: CLRN, PRN
  DFF inst446 (.CLK(Clock), .D(inst433_q), .Q(S62));  // open: CLRN, PRN
  DFF inst447 (.CLK(Clock), .D(inst438_q), .Q(S63));  // open: CLRN, PRN
  DFF inst450 (.CLK(Clock), .D(inst449_q), .Q(S64));  // open: CLRN, PRN
endmodule
